# EAGLE design Board_v4 (EAGLE 8.6.0)
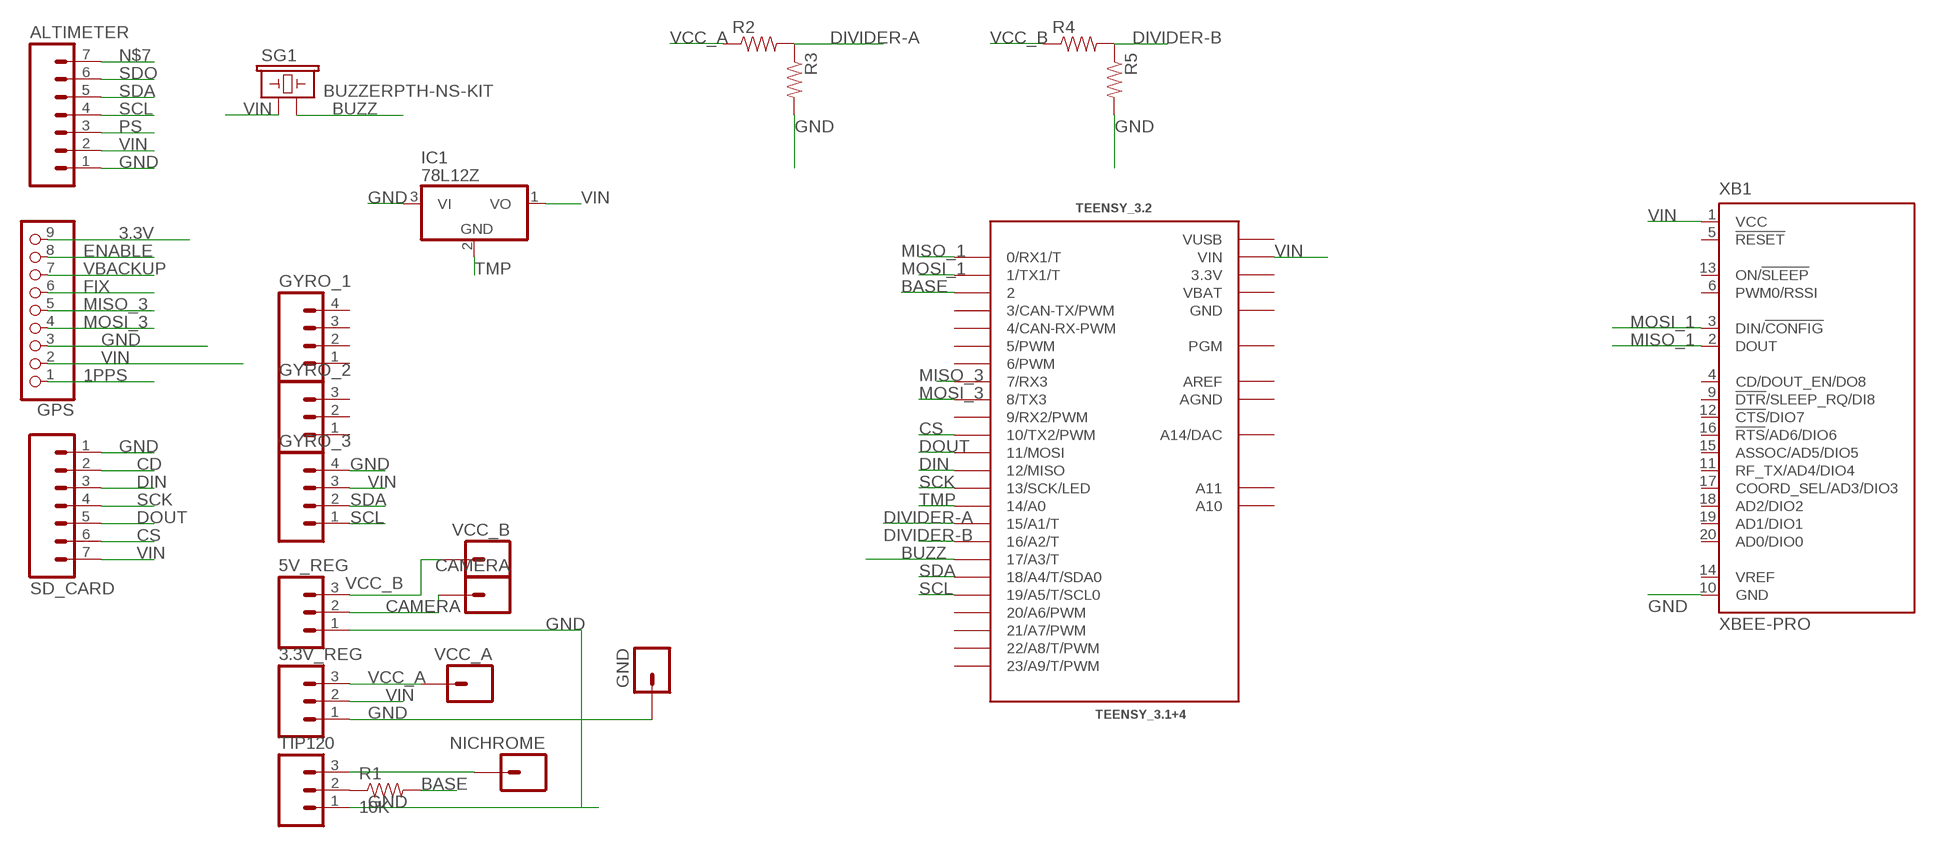
[diagram p0: schematic, sheet 1]

## Parts
3.3V_REG  M03PTH  [1X03]
5V_REG  M03PTH  [1X03]
ALTIMETER  M07  [1X07]
CAMERA  M01NOSILK-KIT  [1X01NS-KIT]
GND  M01PTH_LONGPAD  [1X01_LONGPAD]
GPS  HEADER-1X970MIL  [1X09_ROUND_70]
GYRO_1  M04PTH  [1X04]
GYRO_2  M03PTH  [1X03]
GYRO_3  M04PTH  [1X04]
IC1  78L12Z  [TO92]
NICHROME  M01PTH_LONGPAD  [1X01_LONGPAD]
R1  10K  RESISTOREZ  [AXIAL-0.3EZ]
R2  RESISTORAXIAL-0.3  [AXIAL-0.3]
R3  RESISTORAXIAL-0.3  [AXIAL-0.3]
R4  RESISTORAXIAL-0.3  [AXIAL-0.3]
R5  RESISTORAXIAL-0.3  [AXIAL-0.3]
SD_CARD  M07  [1X07]
SG1  BUZZERPTH-NS-KIT  [BUZZER-12MM-NS-KIT]
TEENSY_3.2  TEENSY_3.1+4  [TEENSY_3.1+4]
TIP120  M03PTH  [1X03]
VCC_A  M01PTH_LONGPAD  [1X01_LONGPAD]
VCC_B  M01OFFSET  [1X01_OFFSET]
XB1  XBEE-PRO  [XBEE-PRO]

## Nets
1PPS: GPS.1
3.3V: GPS.9
BASE: R1.P$2 TEENSY_3.2.2
BUZZ: SG1.- TEENSY_3.2.17/A3(17/A3/T)
CAMERA: 5V_REG.2 CAMERA.1
CD: SD_CARD.2
CS: SD_CARD.6 TEENSY_3.2.10(10/TX2/PWM)
DIN: SD_CARD.3 TEENSY_3.2.12(12/MISO)
DIVIDER-A: R2.P$2 R3.P$1 TEENSY_3.2.15/A1(15/A1/T)
DIVIDER-B: R4.P$2 R5.P$1 TEENSY_3.2.16/A2(16/A2/T)
DOUT: SD_CARD.5 TEENSY_3.2.11(11/MOSI)
ENABLE: GPS.8
FIX: GPS.6
GND: 3.3V_REG.1 5V_REG.1 ALTIMETER.1 GND.1 GPS.3 GYRO_3.4 IC1.3(VI) R3.P$2 R5.P$2 SD_CARD.1 TIP120.1 XB1.10(GND)
MISO_1: TEENSY_3.2.0(0/RX1/T) XB1.2(DOUT)
MISO_3: GPS.5 TEENSY_3.2.7(7/RX3)
MOSI_1: TEENSY_3.2.1(1/TX1/T) XB1.3(DIN/!CONFIG)
MOSI_3: GPS.4 TEENSY_3.2.8(8/TX3)
N$1: R1.P$1 TIP120.2
N$2: NICHROME.1 TIP120.3
N$7: ALTIMETER.7
PS: ALTIMETER.3
SCK: SD_CARD.4 TEENSY_3.2.13(13/SCK/LED)
SCL: ALTIMETER.4 GYRO_3.1 TEENSY_3.2.19/A5(19/A5/T/SCL0)
SDA: ALTIMETER.5 GYRO_3.2 TEENSY_3.2.18/A4(18/A4/T/SDA0)
SDO: ALTIMETER.6
TMP: IC1.2(GND) TEENSY_3.2.14/A0
VBACKUP: GPS.7
VCC_A: 3.3V_REG.3 R2.P$1 VCC_A.1
VCC_B: 5V_REG.3 R4.P$1 VCC_B.1
VIN: 3.3V_REG.2 ALTIMETER.2 GPS.2 GYRO_3.3 IC1.1(VO) SD_CARD.7 SG1.+ TEENSY_3.2.VIN XB1.1(VCC)
Unconnected: GYRO_1.1 GYRO_1.2 GYRO_1.3 GYRO_1.4 GYRO_2.1 GYRO_2.2 GYRO_2.3 TEENSY_3.2.3(3/CAN-TX/PWM) TEENSY_3.2.4(4/CAN-RX-PWM) TEENSY_3.2.5(5/PWM) TEENSY_3.2.6(6/PWM) TEENSY_3.2.9(9/RX2/PWM) TEENSY_3.2.20/A6(20/A6/PWM) TEENSY_3.2.21/A7(21/A7/PWM) TEENSY_3.2.22/A8(22/A8/T/PWM) TEENSY_3.2.23/A9(23/A9/T/PWM) TEENSY_3.2.A10 TEENSY_3.2.A11 TEENSY_3.2.A14(A14/DAC) TEENSY_3.2.PGM XB1.4(CD/DOUT_EN/DO8) XB1.5(!RESET) XB1.6(PWM0/RSSI) XB1.9(!DTR!/SLEEP_RQ/DI8) XB1.11(RF_TX/AD4/DIO4) XB1.12(!CTS!/DIO7) XB1.13(ON/!SLEEP) XB1.14(VREF) XB1.15(ASSOC/AD5/DIO5) XB1.16(!RTS!/AD6/DIO6) XB1.17(COORD_SEL/AD3/DIO3) XB1.18(AD2/DIO2) XB1.19(AD1/DIO1) XB1.20(AD0/DIO0)

## Power pins joined to a net without a drawn wire
3.3V: TEENSY_3.2.3.3V TEENSY_3.2.3.3V1(3.3V)
AGND: TEENSY_3.2.AGND
AREF: TEENSY_3.2.AREF
GND: TEENSY_3.2.GND TEENSY_3.2.GND1(GND)
VBAT: TEENSY_3.2.VBAT
VUSB: TEENSY_3.2.VUSB

## Library data of the parts
3.3V_REG 5V_REG GYRO_2 TIP120 = SparkFun-Connectors:M03: Header 3 Standard 3-pin 0.1" header. Use with straight break away headers (SKU : PRT-00116), right angle break away headers (PRT-00553), swiss pins (PRT-00743), machine pins (PRT-00117), and female headers (PRT-00115). Molex polarized connector foot print use with SKU : PRT-08232 with associated crimp pins and housings.
ALTIMETER SD_CARD = SparkFun-Connectors:M07: Header 7 Standard 7-pin 0.1" header. Use with straight break away headers (SKU : PRT-00116), right angle break away headers (PRT-00553), swiss pins (PRT-00743), machine pins (PRT-00117), and female headers (PRT-00115). NOTES ON THE VARIANTS LOCK and LOCK_LONGPADS... This footprint was designed to help hold the alignment of a through-hole component (i.e. 7-pin header) while soldering it into place. You may notice that each hole has been shifted either up or down by 0.005 of an inch from it's more standard position (which is usually a perfectly straight line). This slight alteration caused the pins (the squares in the middle) to touch the edges of the holes. Because they are alternating, it causes a "brace" to hold the header in place. 0.005 has proven to be the perfect amount of "off-center" position when using our standard breakaway headers. Although looks a little odd when you look at the bare footprint, once you have a header in there, the alteration is very hard to notice. Also, if you push a header all the way into place, it is covered up entirely on the bottom side. This idea of altering the position of holes to aid alignment will be further integrated into the Sparkfun Library for other footprints. It can help hold any component with 3 or more connection pins.
CAMERA GND NICHROME VCC_A VCC_B = SparkFun-Connectors:M01: Header 1 Standard 1-pin 0.1" header. Use with straight break away headers (SKU : PRT-00116), right angle break away headers (PRT-00553), swiss pins (PRT-00743), machine pins (PRT-00117), and female headers (PRT-00115). SMTSO-256-ET is a "flush mount" nut for a 4-40 screw. The older package used to be too tight, and did not allow it to sit properly thru the drill hit. The latest (0.165DIA) fits nice and snug.
GPS = microbuilder:HEADER-1X9: PIN HEADER
GYRO_1 GYRO_3 = SparkFun-Connectors:M04: Header 4 Standard 4-pin 0.1" header. Use with straight break away headers (SKU : PRT-00116), right angle break away headers (PRT-00553), swiss pins (PRT-00743), machine pins (PRT-00117), and female headers (PRT-00115). Molex polarized connector foot print use with SKU : PRT-08231 with associated crimp pins and housings. 1MM SMD Version SKU: PRT-10208; PROD_ID: CONN-09696
IC1 = adafruit:78*: Positive VOLTAGE REGULATOR Added bigger pads to the TO-92 package
R1 = SparkFun-Passives:RESISTOR: Resistor Basic schematic elements and footprints for 0603, 1206, and PTH resistors.
R2-R5 = SparkFun-Resistors:RESISTOR: Resistor Basic schematic elements and footprints for 0603, 1206, and PTH resistors.
SG1 = SparkFun:BUZZER: Buzzer 12mm Spark Fun Electronics SKU : Comp-Buzzer
TEENSY_3.2 = Teensy_3_Series_Board_v1.0:TEENSY_3.1+4: Footprint for Teensy 3.1 board using all through-holes, i.e. the entire perimeter plus the 4 through-holes inboard (A10,A11,AREF, VUSB)
XB1 = maxstream:XBEE: XBee (TM) /XBee-PRO(TM) OEM RF Modules Source: MaxStream, Inc. xbee_productmanual.pdf; MPN: XBP24-AWI-001; OC_FARNELL: 1337916; OC_NEWARK: 42M2667

## Net classes
0 default: clearance 0.205 mm

## Board
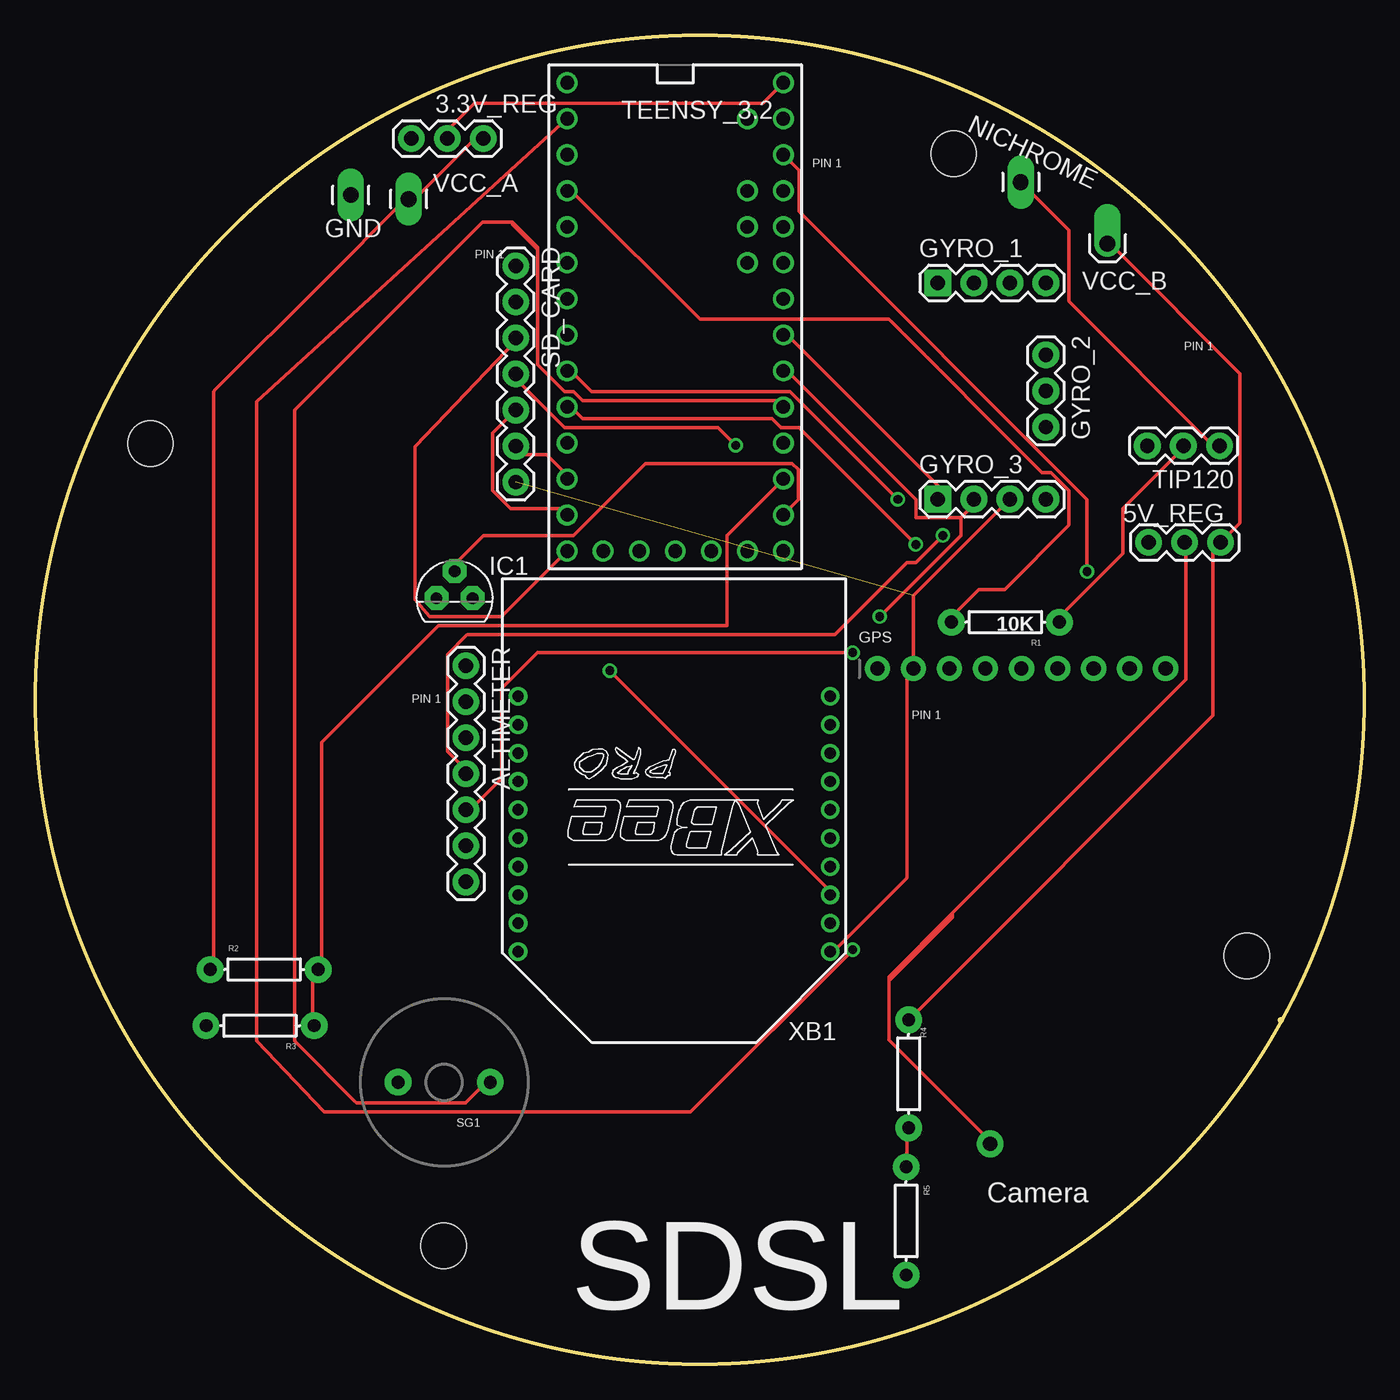
[diagram p1: board, top side]
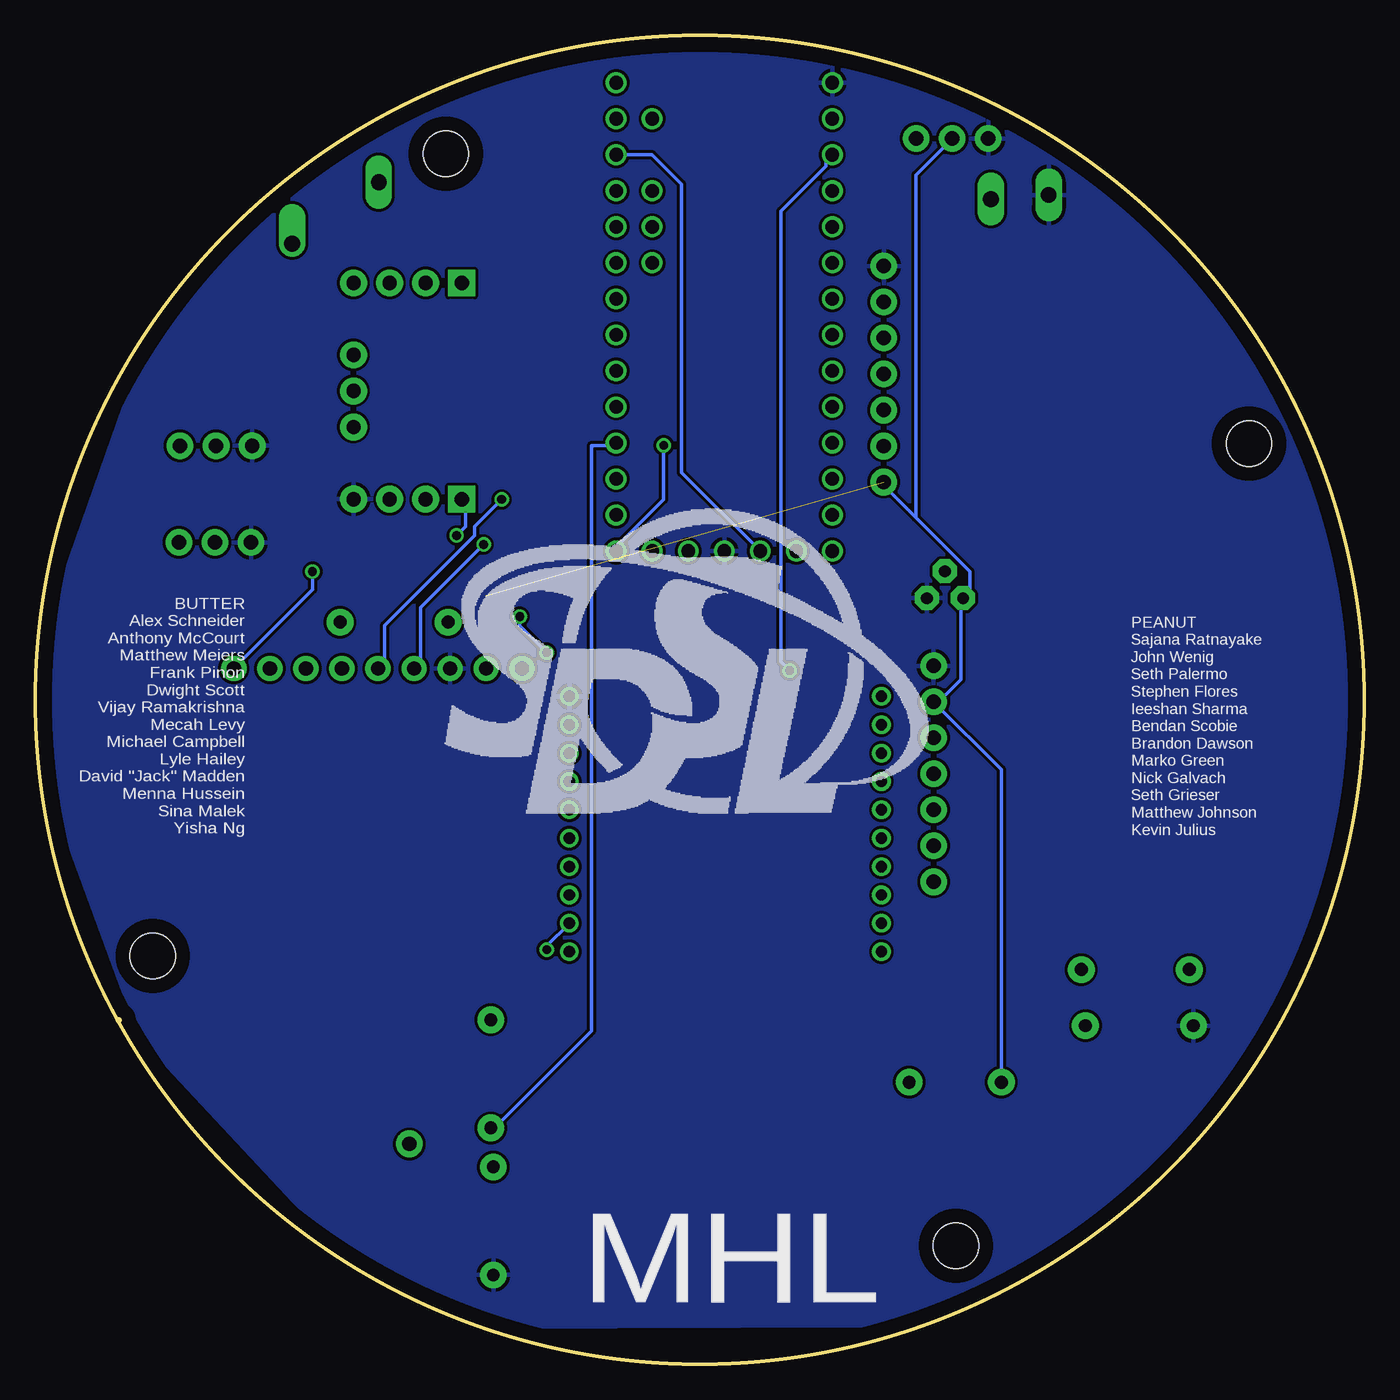
[diagram p2: board, bottom side, seen from below]

Size 93.69 x 93.69 mm. Coordinates in mm from the lower left corner, seen from the top.
Outline: 87.82,24.26 87.81,24.24
Outline: circle at 46.84,46.84 radius 46.84
Copper layers (1*16): Top 0.035mm / dielectric 1.5mm / Bottom 0.035mm
Design rules "default": minimum track width 10mil, minimum drill 24mil, track to track 8mil, track to pad 8mil, pad to pad 8mil, via to via 8mil, smd to smd 8mil, copper to edge 40mil, drill to drill 8mil, minimum pad ring 10mil, minimum via ring 8mil, stop-mask expansion 4mil, vias tented up to drill 0mil, thermal gap 10mil
Holes 3.2 mm at 64.75,85.35 85.43,28.78 8.11,64.9 28.78,8.34

### Footprints (pad centres in the part's own frame; a part is rotated, then mirrored left to right if it is on the bottom)
1X03 = drill 1.016 pad 1.88: 1 0,0; 2 2.54,0; 3 5.08,0
1X07 = drill 1.016 pad 1.88: 1 0,0; 2 2.54,0; 3 5.08,0; 4 7.62,0; 5 10.16,0; 6 12.7,0; 7 15.24,0
1X01NS-KIT = drill 1.016 pad 1.88: 1 0,0
1X01_LONGPAD = drill 1.118 pad 1.88 long: 1 0,0
1X09_ROUND_70 = drill 1 pad 1.778: 1 -10.16,0; 2 -7.62,0; 3 -5.08,0; 4 -2.54,0; 5 0,0; 6 2.54,0; 7 5.08,0; 8 7.62,0; 9 10.16,0
1X04 = drill 1.016 pad 1.88 square: 1 0,0 | drill 1.016 pad 1.88: 2 2.54,0; 3 5.08,0; 4 7.62,0
TO92 = drill 0.813 pad 1.676 octagon: 1 -1.27,0; 2 0,1.905; 3 1.27,0
AXIAL-0.3EZ = drill 0.9 pad 1.88: P$1 -3.81,0; P$2 3.81,0
AXIAL-0.3 = drill 0.9 pad 1.88: P$1 -3.81,0; P$2 3.81,0
BUZZER-12MM-NS-KIT = drill 0.9 pad 1.88: + 3.25,0; - -3.25,0
TEENSY_3.1+4 = drill 0.965: 0 -7.62,15.24; 1 -7.62,12.7; 2 -7.62,10.16; 3 -7.62,7.62; 3.3V 7.62,12.7; 3.3V1 -2.54,-15.24; 4 -7.62,5.08; 5 -7.62,2.54; 6 -7.62,0; 7 -7.62,-2.54; 8 -7.62,-5.08; 9 -7.62,-7.62; 10 -7.62,-10.16; 11 -7.62,-12.7; 12 -7.62,-15.24; 13 7.62,-15.24; 14/A0 7.62,-12.7; 15/A1 7.62,-10.16; 16/A2 7.62,-7.62; 17/A3 7.62,-5.08; 18/A4 7.62,-2.54; 19/A5 7.62,0; 20/A6 7.62,2.54; 21/A7 7.62,5.08; 22/A8 7.62,7.62; 23/A9 7.62,10.16; A10 5.08,7.62; A11 5.08,5.08; A14 5.08,-15.24; AGND 7.62,15.24; AREF 5.08,10.16; GND -7.62,17.78; GND1 0,-15.24; PGM 2.54,-15.24; VBAT -5.08,-15.24; VIN 7.62,17.78; VUSB 5.08,15.24
1X01_OFFSET = drill 1.118 pad 1.88 offset: 1 0,0
XBEE-PRO = drill 0.8 pad 1.27: 1 -11,9; 2 -11,7; 3 -11,5; 4 -11,3; 5 -11,1; 6 -11,-1; 7 -11,-3; 8 -11,-5; 9 -11,-7; 10 -11,-9; 11 11,-9; 12 11,-7; 13 11,-5; 14 11,-3; 15 11,-1; 16 11,1; 17 11,3; 18 11,5; 19 11,7; 20 11,9

### Placement (x,y rotation side)
3.3V_REG  26.5,86.42 0 top
5V_REG  78.49,57.94 0 top
ALTIMETER  30.36,49.24 270 top
CAMERA  67.32,15.53 0 top
GND  22.24,82.44 180 top
GPS  69.54,49.05 0 top
GYRO_1  63.63,76.23 0 top
GYRO_2  71.25,71.15 270 top
GYRO_3  63.63,60.99 0 top
IC1  29.55,54.01 0 top
NICHROME  69.48,83.34 0 top
R1  68.4,52.32 180 top
R2  16.13,27.82 0 top
R3  15.84,23.86 180 top
R4  61.58,20.46 270 top
R5  61.4,10.09 270 top
SD_CARD  33.86,77.43 270 top
SG1  28.83,19.87 180 top
TEENSY_3.2  45.12,72.57 0 top
TIP120  78.41,64.75 0 top
VCC_A  26.32,82.15 180 top
VCC_B  75.6,79.01 0 top
XB1  45.03,38.08 180 top

### Tracks (layer width: path | path; a pad name or v marks a point on that pad's centre or on a via)
3.3V  (via drill 0.61)
  Top 0.254: v74.15,55.89 74.15,60.97 53.83,81.29 53.83,84.18 TEENSY_3.2.3.3V
  Bottom 0.254: TEENSY_3.2.3.3V1 48.11,62.87 48.11,83.19 50.2,85.27 52.6,85.27 TEENSY_3.2.3.3V | v74.15,55.89 74.15,54.62 79.23,49.54 GPS.9
BASE
  Top 0.254: TEENSY_3.2.2 37.95,82.56 46.84,73.67 60.18,73.67 70.97,62.87 71.61,62.87 72.88,61.6 72.88,59.36 72.88,59.15 68.35,54.62 66.53,54.62 64.62,52.71 R1.P$2
BUZZ
  Top 0.254: 35.41,78.57 35.41,78.75 33.64,80.52 | 35.41,78.57 35.41,70.49 37.32,68.59 37.95,68.59 38.59,67.95 52.56,67.95 TEENSY_3.2.17/A3 | 18.27,22.95 18.27,22.78 22.48,18.57 22.63,18.42 22.8,18.42 30.33,18.42 31.6,19.69 SG1.- | 18.27,22.95 18.27,67.27 31.52,80.52 33.64,80.52 | 35.41,78.57 33.64,80.35 33.64,80.52 | 18.27,22.95
CAMERA
  Top 0.254: 60.18,27.02 60.18,27.31 64.67,31.8 | 60.18,27.02 60.18,22.87 67.16,15.88 CAMERA.1 | 64.67,31.8 81.13,48.27 81.13,57.79 5V_REG.2 | 60.18,27.02 64.67,31.5 64.67,31.8
CS
  Top 0.254: TEENSY_3.2.10 37.32,62.87 36.05,64.14 34.14,64.14 SD_CARD.6
DIN
  Top 0.254: TEENSY_3.2.12 32.87,52.71 27.79,52.71 26.78,53.9 26.78,64.69 33.17,71.42 33.51,71.76 SD_CARD.3
DIVIDER-A
  Top 0.254: TEENSY_3.2.15/A1 48.75,58.43 48.75,52.08 28.43,52.08 20.17,43.82 20.17,27.95 R2.P$2 19.54,27.31 19.54,24.14 R3.P$1
DIVIDER-B
  Top 0.254: R5.P$1 61.45,13.98 61.45,16.52 R4.P$2
  Bottom 0.254: TEENSY_3.2.16/A2 53.19,64.78 54.46,64.78 54.46,23.5 54.65,23.31 61.45,16.52 R4.P$2
DOUT
  Top 0.254: TEENSY_3.2.11 37.32,60.33 33.51,60.33 32.24,61.6 32.24,65.65 33.52,66.93 SD_CARD.5 33.51,66.68
GND
  pour Bottom: 21.24,8.4 26.41,5.32 35.27,2.74 61.4,2.62 63.31,3.36 70.49,6.15 86.31,23.1 91.94,38.48 93.54,43.44 92.5,53.1 86.66,69.65 82.99,75.53 79.18,80.47 77.12,82.53 77.02,82.53 76.21,83.34 76.05,83.34 75.77,83.62 75.65,83.62 75.01,84.26 74.81,84.26 74.23,84.84 74,84.84 73.51,85.33 73.36,85.33 72.93,85.76 72.65,85.76 72.32,86.09 72.07,86.09 71.84,86.32 68.48,87.92 63.18,90.43 54.36,92.64 37.45,92.64 37.01,92.21 35.57,92.21 34.8,91.45 32.06,91.45 31.3,90.68 30.28,90.68 28.99,89.39 27.57,89.39 27.03,88.86 26.3,88.86 25.74,88.3 25.18,88.3 24.54,87.66 24.06,87.66 23.25,86.85 22.41,86.85 21.75,86.19 21.57,86.19 21.14,85.76 20.73,85.76 20.38,85.4 20.38,85.22 20.33,85.17 20.17,85.17 19.97,84.97 19.74,84.97 19.26,84.49 19.26,83.83 18.07,82.63 15.61,80.42 12.61,77.13 10.39,75.29 7.98,71.36 5.43,67.27 3.14,62.36 0.8,49.19 1.14,39.07 2.24,35.94 2.75,33.53 3.28,31.14 4.3,29.01 10.37,18.03 11.08,17.19 19.26,9.91
MISO_1  (via drill 0.61)
  Top 0.254: v57.64,29.22 46.21,17.79 20.35,17.79 15.6,22.78 15.6,67.87 TEENSY_3.2.0
  Bottom 0.254: XB1.2 57.64,29.47 v57.64,29.22
MISO_3  (via drill 0.61)
  Top 0.254: v60.81,60.97 53.19,68.59 39.22,68.59 37.95,69.86 TEENSY_3.2.7
  Bottom 0.254: v60.81,60.97 62.72,59.06 62.72,58.43 69.07,52.08 69.07,49.54 GPS.5
MOSI_1  (via drill 0.61)
  Top 0.254: v40.49,48.9 55.73,33.66 XB1.3
  Bottom 0.254: v40.49,48.9 41.13,49.54 41.13,81.29 37.95,84.46 37.95,85.1 TEENSY_3.2.1
MOSI_3  (via drill 0.61)
  Top 0.254: v62.08,57.79 53.83,66.05 52.56,66.05 51.92,66.68 38.59,66.68 37.95,67.32 TEENSY_3.2.8
  Bottom 0.254: v62.08,57.79 66.53,53.35 66.53,49.54 GPS.4
N$1
  Top 0.254: R1.P$1 72.24,52.71 76.69,57.16 76.69,60.33 79.14,62.78 80.5,64.14 TIP120.2
N$2
  Top 0.254: TIP120.3 83.04,64.78 72.88,74.94 72.88,79.94 70.58,82.24 NICHROME.1 69.7,83.19
SCK  (via drill 0.61)
  Top 0.254: v49.38,64.78 48.11,66.05 37.32,66.05 34.14,69.22 SD_CARD.4
  Bottom 0.254: v49.38,64.78 49.38,60.97 52.56,57.79 TEENSY_3.2.13
SCL  (via drill 0.61)
  Top 0.254: TEENSY_3.2.19/A5 53.19,72.4 63.99,61.6 GYRO_3.1 | v63.99,58.43 62.08,56.52 61.45,56.52 56.37,51.44 30.46,51.44 30.42,51.4 29.06,50.04 29.06,43.19 30.33,41.92 ALTIMETER.4
  Bottom 0.254: v63.99,58.43 63.35,59.06 63.35,60.97 GYRO_3.1
SDA  (via drill 0.61)
  Top 0.254: 65.26,59.7 62.08,59.7 62.08,60.97 53.19,69.86 TEENSY_3.2.18/A4 | 65.26,59.7 66.53,60.97 GYRO_3.2 | v57.64,50.17 35.41,50.17 32.87,47.63 32.87,41.28 30.97,39.38 ALTIMETER.5 | v59.54,52.71 65.26,58.43 65.26,59.7
  Bottom 0.254: v57.64,50.17 59.54,52.08 v59.54,52.71
TMP
  Top 0.254: TEENSY_3.2.14/A0 53.81,60.94 53.81,63.06 53.36,63.51 43.03,63.51 37.95,58.43 31.6,58.43 29.7,56.52 IC1.2
VCC_A
  Top 0.254: R2.P$1 12.55,27.95 12.55,68.59 12.64,68.67 20.34,76.38 25.89,81.92 VCC_A.1 26.52,82.56 27.16,82.56 30.97,86.37 3.3V_REG.3
VCC_B
  Top 0.254: R4.P$1 62.08,24.77 83.04,45.73 83.04,57.79 5V_REG.3 84.94,59.31 84.94,69.86 76.05,78.75 VCC_B.1
VIN  (1 unrouted)
  Top 0.254: TEENSY_3.2.VIN 51.29,88.91 30.97,88.91 29.06,87 3.3V_REG.2 | XB1.1 56.37,29.22 61.45,34.3 61.45,48.9 GPS.2 61.92,54.19 GYRO_3.3
  Bottom 0.254: 31.6,59.7 27.79,55.89 27.79,54.62 IC1.1 28.43,53.98 28.43,48.27 30.33,46.36 ALTIMETER.2 25.58,41.92 SG1.+ | 31.6,59.7 33.51,61.6 SD_CARD.7 | 31.6,59.7 31.6,83.83 29.06,86.37 3.3V_REG.2

### Text on the board
_tsilk: PIN 1 | PIN 1 | PIN 1 | PIN 1 | PIN 1 | Camera | SDSL
_bsilk: BUTTER / Alex Schneider / Anthony McCourt / Matthew Meiers / Frank Pinon / Dwight Scott / Vijay Ramakrishna / Mecah Levy / Michael Campbell / Lyle Hailey / David "Jack" Madden / Menna Hussein / Sina Malek / Yisha Ng | PEANUT / Sajana Ratnayake / John Wenig / Seth Palermo / Stephen Flores / Ieeshan Sharma / Bendan Scobie / Brandon Dawson / Marko Green / Nick Galvach / Seth Grieser / Matthew Johnson / Kevin Julius | MHL